# EAGLE design uMatrixPCB_r1.0 (EAGLE 6.5.0)
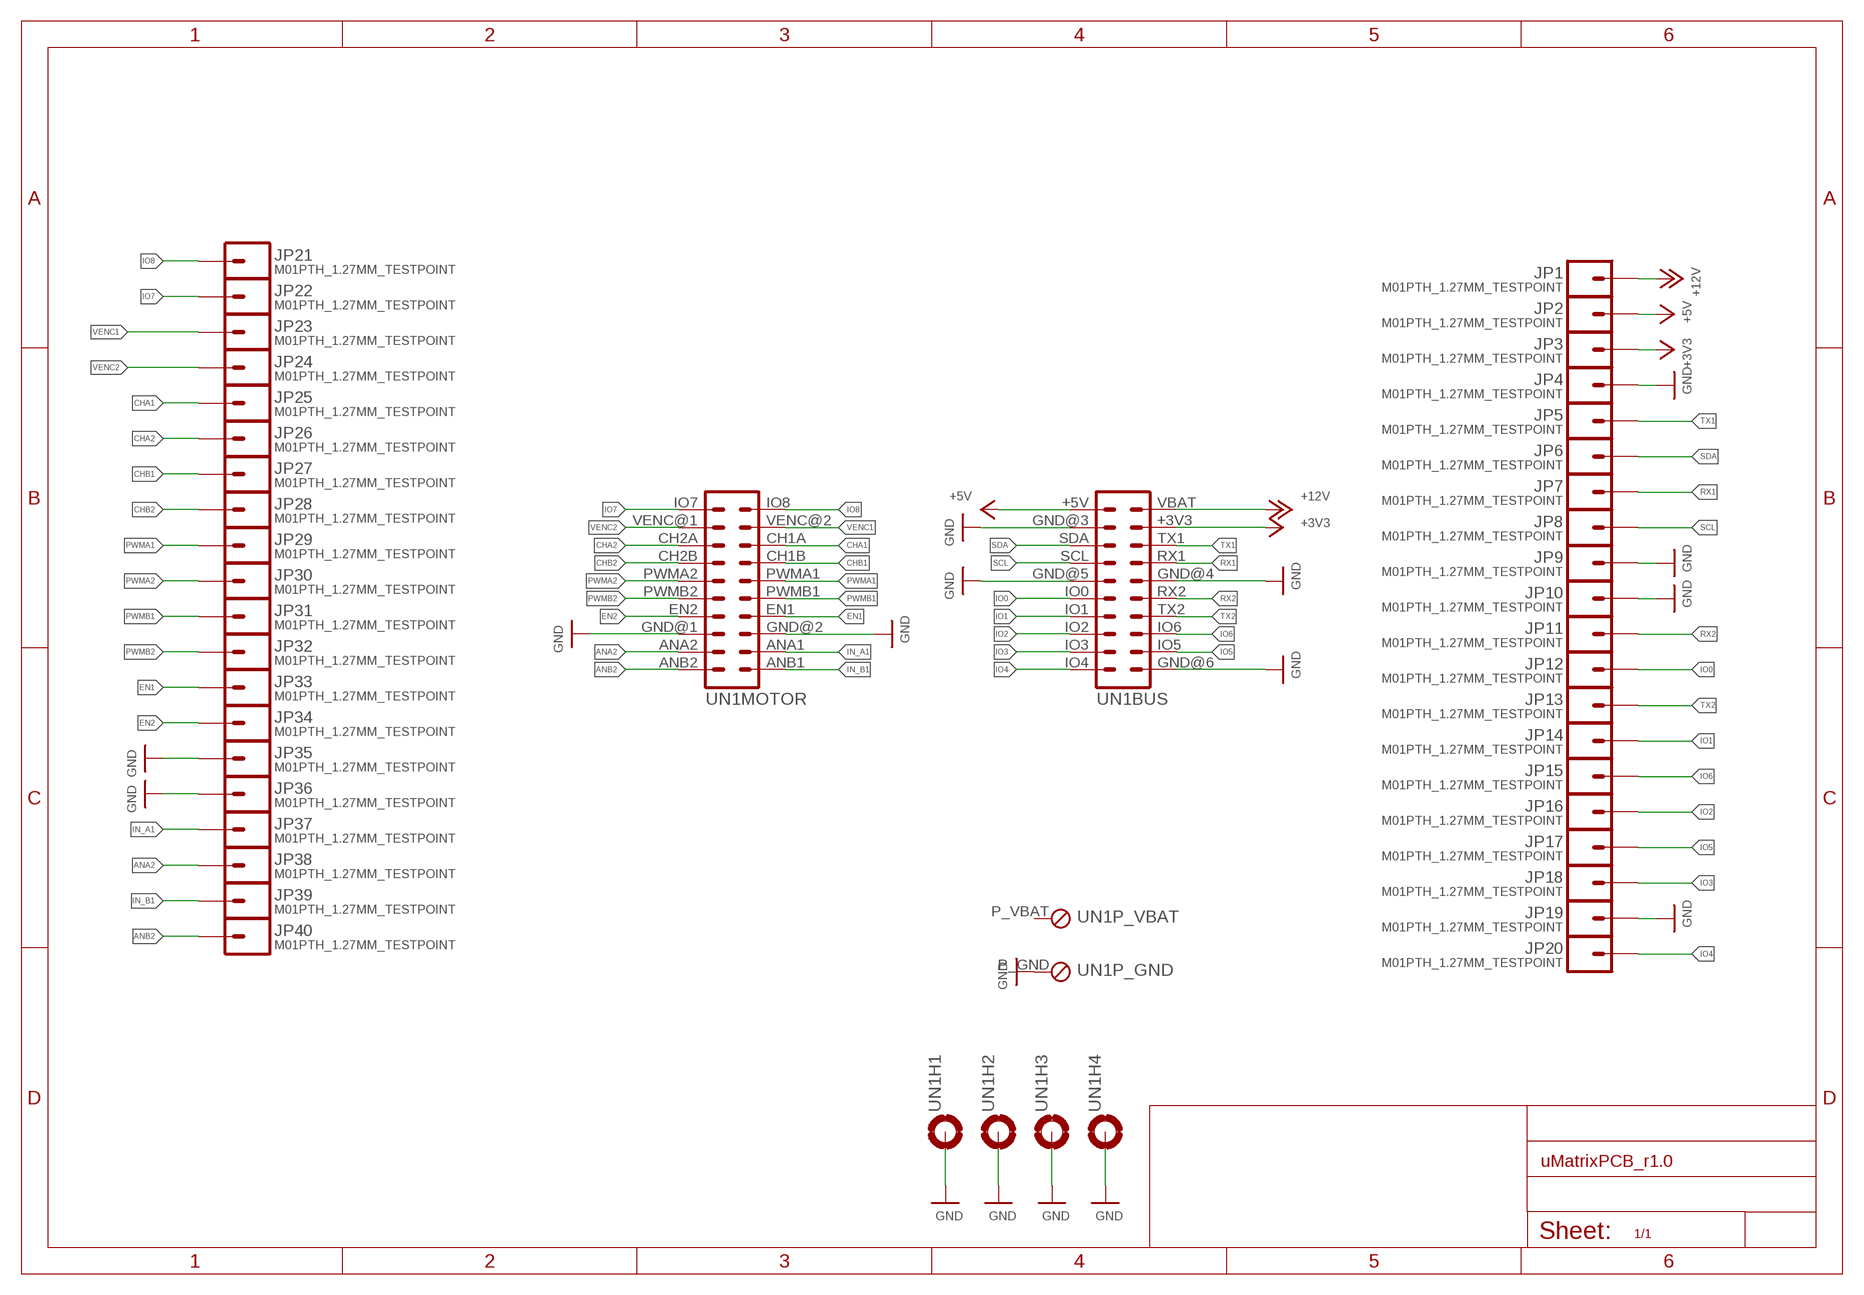
[diagram p0: schematic, sheet 1]

## Parts
JP1  M01PTH_1.27MM_TESTPOINT  [1X0.127_TESTPOINT]
JP2  M01PTH_1.27MM_TESTPOINT  [1X0.127_TESTPOINT]
JP3  M01PTH_1.27MM_TESTPOINT  [1X0.127_TESTPOINT]
JP4  M01PTH_1.27MM_TESTPOINT  [1X0.127_TESTPOINT]
JP5  M01PTH_1.27MM_TESTPOINT  [1X0.127_TESTPOINT]
JP6  M01PTH_1.27MM_TESTPOINT  [1X0.127_TESTPOINT]
JP7  M01PTH_1.27MM_TESTPOINT  [1X0.127_TESTPOINT]
JP8  M01PTH_1.27MM_TESTPOINT  [1X0.127_TESTPOINT]
JP9  M01PTH_1.27MM_TESTPOINT  [1X0.127_TESTPOINT]
JP10  M01PTH_1.27MM_TESTPOINT  [1X0.127_TESTPOINT]
JP11  M01PTH_1.27MM_TESTPOINT  [1X0.127_TESTPOINT]
JP12  M01PTH_1.27MM_TESTPOINT  [1X0.127_TESTPOINT]
JP13  M01PTH_1.27MM_TESTPOINT  [1X0.127_TESTPOINT]
JP14  M01PTH_1.27MM_TESTPOINT  [1X0.127_TESTPOINT]
JP15  M01PTH_1.27MM_TESTPOINT  [1X0.127_TESTPOINT]
JP16  M01PTH_1.27MM_TESTPOINT  [1X0.127_TESTPOINT]
JP17  M01PTH_1.27MM_TESTPOINT  [1X0.127_TESTPOINT]
JP18  M01PTH_1.27MM_TESTPOINT  [1X0.127_TESTPOINT]
JP19  M01PTH_1.27MM_TESTPOINT  [1X0.127_TESTPOINT]
JP20  M01PTH_1.27MM_TESTPOINT  [1X0.127_TESTPOINT]
JP21  M01PTH_1.27MM_TESTPOINT  [1X0.127_TESTPOINT]
JP22  M01PTH_1.27MM_TESTPOINT  [1X0.127_TESTPOINT]
JP23  M01PTH_1.27MM_TESTPOINT  [1X0.127_TESTPOINT]
JP24  M01PTH_1.27MM_TESTPOINT  [1X0.127_TESTPOINT]
JP25  M01PTH_1.27MM_TESTPOINT  [1X0.127_TESTPOINT]
JP26  M01PTH_1.27MM_TESTPOINT  [1X0.127_TESTPOINT]
JP27  M01PTH_1.27MM_TESTPOINT  [1X0.127_TESTPOINT]
JP28  M01PTH_1.27MM_TESTPOINT  [1X0.127_TESTPOINT]
JP29  M01PTH_1.27MM_TESTPOINT  [1X0.127_TESTPOINT]
JP30  M01PTH_1.27MM_TESTPOINT  [1X0.127_TESTPOINT]
JP31  M01PTH_1.27MM_TESTPOINT  [1X0.127_TESTPOINT]
JP32  M01PTH_1.27MM_TESTPOINT  [1X0.127_TESTPOINT]
JP33  M01PTH_1.27MM_TESTPOINT  [1X0.127_TESTPOINT]
JP34  M01PTH_1.27MM_TESTPOINT  [1X0.127_TESTPOINT]
JP35  M01PTH_1.27MM_TESTPOINT  [1X0.127_TESTPOINT]
JP36  M01PTH_1.27MM_TESTPOINT  [1X0.127_TESTPOINT]
JP37  M01PTH_1.27MM_TESTPOINT  [1X0.127_TESTPOINT]
JP38  M01PTH_1.27MM_TESTPOINT  [1X0.127_TESTPOINT]
JP39  M01PTH_1.27MM_TESTPOINT  [1X0.127_TESTPOINT]
JP40  M01PTH_1.27MM_TESTPOINT  [1X0.127_TESTPOINT]
UN1  UNAV  [UNAV_BOARD]

## Nets
+3V3: JP3.1 UN1.+3V3
+5V: JP2.1 UN1.+5V
+12V: JP1.1 UN1.VBAT
ANA2: JP38.1 UN1.ANA2
ANB2: JP40.1 UN1.ANB2
CHA1: JP25.1 UN1.CH1A
CHA2: JP26.1 UN1.CH2A
CHB1: JP27.1 UN1.CH1B
CHB2: JP28.1 UN1.CH2B
EN1: JP33.1 UN1.EN1
EN2: JP34.1 UN1.EN2
GND: JP4.1 JP9.1 JP10.1 JP19.1 JP35.1 JP36.1 UN1.GND@1 UN1.GND@2 UN1.GND@3 UN1.GND@4 UN1.GND@5 UN1.GND@6 UN1.H1(H1:MOUNT) UN1.H2(H2:MOUNT) UN1.H3(H3:MOUNT) UN1.H4(H4:MOUNT) UN1.P_GND
IN_A1: JP37.1 UN1.ANA1
IN_B1: JP39.1 UN1.ANB1
IO0: JP12.1 UN1.IO0
IO1: JP14.1 UN1.IO1
IO2: JP16.1 UN1.IO2
IO3: JP18.1 UN1.IO3
IO4: JP20.1 UN1.IO4
IO5: JP17.1 UN1.IO5
IO6: JP15.1 UN1.IO6
IO7: JP22.1 UN1.IO7
IO8: JP21.1 UN1.IO8
PWMA1: JP29.1 UN1.PWMA1
PWMA2: JP30.1 UN1.PWMA2
PWMB1: JP31.1 UN1.PWMB1
PWMB2: JP32.1 UN1.PWMB2
RX1: JP7.1 UN1.RX1
RX2: JP11.1 UN1.RX2
SCL: JP8.1 UN1.SCL
SDA: JP6.1 UN1.SDA
TX1: JP5.1 UN1.TX1
TX2: JP13.1 UN1.TX2
VENC1: JP23.1 UN1.VENC@2
VENC2: JP24.1 UN1.VENC@1
Unconnected: UN1.P_VBAT

## Library data of the parts
JP1-JP40 = OfficineRobotiche:M01: Header 1 Standard 1-pin 0.1" header. Use with straight break away headers (SKU : PRT-00116), right angle break away headers (PRT-00553), swiss pins (PRT-00743), machine pins (PRT-00117), and female headers (PRT-00115).
UN1 = OfficineRobotiche:UNAV: https://github.com/officinerobotiche/uNAVPCB

## Net classes
0 default: width 0.254 mm, drill 0.406 mm, clearance 0.178 mm
1 power: width 0.305 mm, drill 0.406 mm, clearance 0.203 mm

## Board
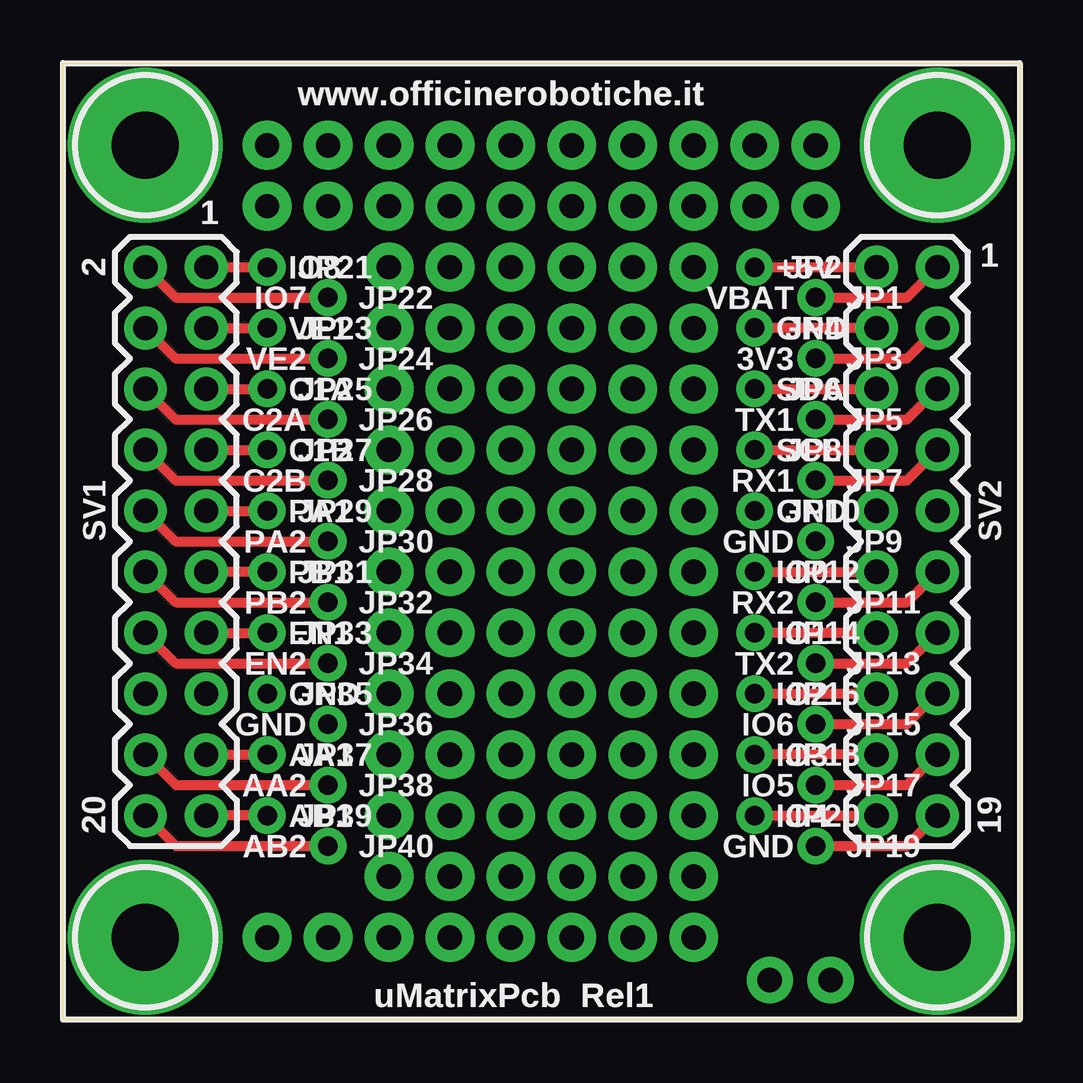
[diagram p1: board, top side]
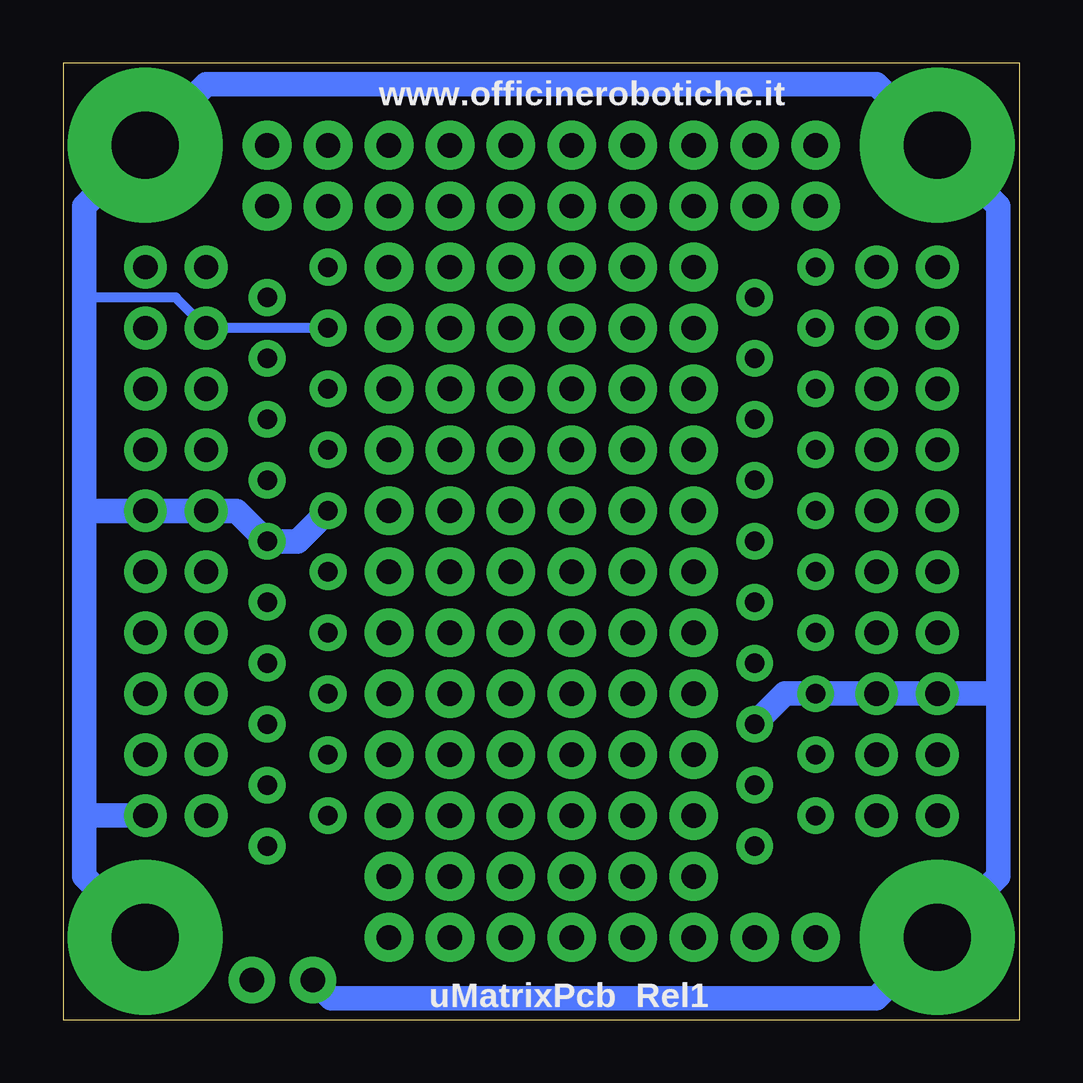
[diagram p2: board, bottom side, seen from below]

Size 39.88 x 39.88 mm. Coordinates in mm from the lower left corner, seen from the top.
Outline: 39.88,0 0,0 0,39.88 39.88,39.88 39.88,0
Copper layers (1*16): Top 0.035mm / dielectric 1.5mm / Bottom 0.035mm
Design rules "default": minimum track width 8mil, minimum drill 12mil, track to track 8mil, track to pad 8mil, pad to pad 8mil, via to via 8mil, smd to smd 8mil, copper to edge 10mil, drill to drill 8mil, minimum pad ring 12mil, minimum via ring 8mil, stop-mask expansion 4mil, vias tented up to drill 20mil, thermal gap 10mil

### Footprints (pad centres in the part's own frame; a part is rotated, then mirrored left to right if it is on the bottom)
1X0.127_TESTPOINT = drill 0.813 pad 1.524: 1 0,0
UNAV_BOARD = drill 1.016 pad 1.778: +3V3 33.02,25.4; +5V 30.48,27.94; ANA1 2.54,7.62; ANA2 0,7.62; ANB1 2.54,5.08; ANB2 0,5.08; CH1A 2.54,22.86; CH1B 2.54,20.32; CH2A 0,22.86; CH2B 0,20.32; EN1 2.54,12.7; EN2 0,12.7; GND@1 0,10.16; GND@2 2.54,10.16; GND@3 30.48,25.4; GND@4 33.02,17.78; GND@5 30.48,17.78; GND@6 33.02,5.08; IO0 30.48,15.24; IO1 30.48,12.7; IO2 30.48,10.16; IO3 30.48,7.62; IO4 30.48,5.08; IO5 33.02,7.62; IO6 33.02,10.16; IO7 0,27.94; IO8 2.54,27.94; PWMA1 2.54,17.78; PWMA2 0,17.78; PWMB1 2.54,15.24; PWMB2 0,15.24; RX1 33.02,20.32; RX2 33.02,15.24; SCL 30.48,20.32; SDA 30.48,22.86; TX1 33.02,22.86; TX2 33.02,12.7; VBAT 33.02,27.94; VENC@1 0,25.4; VENC@2 2.54,25.4 | drill 2.8 pad 6.452: H1 0,33.02; H2 33.02,33.02; H3 33.02,0; H4 0,0 | drill 1.016 pad 1.93: P_GND 26.035,-1.778; P_VBAT 28.575,-1.778

### Placement (x,y rotation side)
JP1  31.37,30.1 0 top
JP2  28.83,31.37 0 top
JP3  31.37,27.56 0 top
JP4  28.83,28.83 0 top
JP5  31.37,25.02 0 top
JP6  28.83,26.29 0 top
JP7  31.37,22.48 0 top
JP8  28.83,23.75 0 top
JP9  31.37,19.94 0 top
JP10  28.83,21.21 0 top
JP11  31.37,17.4 0 top
JP12  28.83,18.67 0 top
JP13  31.37,14.86 0 top
JP14  28.83,16.13 0 top
JP15  31.37,12.32 0 top
JP16  28.83,13.59 0 top
JP17  31.37,9.78 0 top
JP18  28.83,11.05 0 top
JP19  31.37,7.24 0 top
JP20  28.83,8.51 0 top
JP21  8.51,31.37 0 top
JP22  11.05,30.1 0 top
JP23  8.51,28.83 0 top
JP24  11.05,27.56 0 top
JP25  8.51,26.29 0 top
JP26  11.05,25.02 0 top
JP27  8.51,23.75 0 top
JP28  11.05,22.48 0 top
JP29  8.51,21.21 0 top
JP30  11.05,19.94 0 top
JP31  8.51,18.67 0 top
JP32  11.05,17.4 0 top
JP33  8.51,16.13 0 top
JP34  11.05,14.86 0 top
JP35  8.51,13.59 0 top
JP36  11.05,12.32 0 top
JP37  8.51,11.05 0 top
JP38  11.05,9.78 0 top
JP39  8.51,8.51 0 top
JP40  11.05,7.24 0 top
UN1  3.43,3.43 0 top

### Tracks (layer width: path | path; a pad name or v marks a point on that pad's centre or on a via)
+3V3
  Top 0.406: JP3.1 35.18,27.56 UN1.+3V3
+5V
  Top 0.406: JP2.1 UN1.+5V
+12V
  Top 0.406: JP1.1 35.18,30.1 UN1.VBAT
ANA2
  Top 0.406: UN1.ANA2 4.7,9.78 JP38.1
ANB2
  Top 0.406: UN1.ANB2 4.7,7.24 JP40.1
CHA1
  Top 0.406: UN1.CH1A JP25.1
CHA2
  Top 0.406: UN1.CH2A 4.7,25.02 JP26.1
CHB1
  Top 0.406: UN1.CH1B JP27.1
CHB2
  Top 0.406: UN1.CH2B 4.7,22.48 JP28.1
EN1
  Top 0.406: UN1.EN1 JP33.1
EN2
  Top 0.406: UN1.EN2 4.7,14.86 JP34.1
GND
  Top 0.406: JP19.1 35.18,7.24 UN1.GND@6 | UN1.GND@3 JP4.1
  Bottom 0.406: JP4.1 UN1.GND@3 35.18,30.1 38.99,30.1
  Bottom 1.016: UN1.H3 38.99,5.97 38.99,8.51 | 38.99,8.51 38.99,21.21 | 38.99,21.21 38.99,30.1 38.99,33.91 UN1.H2 33.91,38.99 5.97,38.99 UN1.H1 0.89,33.91 0.89,13.59 | 0.89,13.59 0.89,5.97 UN1.H4 5.97,0.89 | UN1.P_GND 28.7,0.89 5.97,0.89 | 6.86,0.89 5.97,0.89 | UN1.GND@6 38.99,8.51 | 38.99,21.21 UN1.GND@4 UN1.GND@5 32.64,21.21 JP9.1 30.1,19.94 JP10.1 | 0.89,13.59 UN1.GND@1 UN1.GND@2 JP35.1 9.78,13.59 JP36.1
IN_A1
  Top 0.406: UN1.ANA1 JP37.1
IN_B1
  Top 0.406: JP39.1 UN1.ANB1
IO0
  Top 0.406: JP12.1 UN1.IO0
IO1
  Top 0.406: UN1.IO1 JP14.1
IO2
  Top 0.406: JP16.1 UN1.IO2
IO3
  Top 0.406: UN1.IO3 JP18.1
IO4
  Top 0.406: JP20.1 UN1.IO4
IO5
  Top 0.406: JP17.1 35.18,9.78 UN1.IO5
IO6
  Top 0.406: JP15.1 35.18,12.32 UN1.IO6
IO7
  Top 0.406: UN1.IO7 4.7,30.1 JP22.1
IO8
  Top 0.406: UN1.IO8 JP21.1
N$1  (via drill 1.02 pad 2.03)
  other vias: 8.51,3.43
N$2  (via drill 1.02 pad 2.03)
  other vias: 11.05,3.43
N$3  (via drill 1.02 pad 2.03)
  other vias: 16.13,3.43
N$4  (via drill 1.02 pad 2.03)
  other vias: 13.59,3.43
N$5  (via drill 1.02 pad 2.03)
  other vias: 18.67,3.43
N$6  (via drill 1.02 pad 2.03)
  other vias: 21.21,3.43
N$7  (via drill 1.02 pad 2.03)
  other vias: 23.75,3.43
N$8  (via drill 1.02 pad 2.03)
  other vias: 26.29,3.43
N$13  (via drill 1.02 pad 2.03)
  other vias: 8.51,33.91
N$14  (via drill 1.02 pad 2.03)
  other vias: 8.51,36.45
N$15  (via drill 1.02 pad 2.03)
  other vias: 11.05,36.45
N$16  (via drill 1.02 pad 2.03)
  other vias: 13.59,36.45
N$17  (via drill 1.02 pad 2.03)
  other vias: 16.13,36.45
N$18  (via drill 1.02 pad 2.03)
  other vias: 18.67,36.45
N$19  (via drill 1.02 pad 2.03)
  other vias: 21.21,36.45
N$20  (via drill 1.02 pad 2.03)
  other vias: 23.75,36.45
N$21  (via drill 1.02 pad 2.03)
  other vias: 26.29,36.45
N$22  (via drill 1.02 pad 2.03)
  other vias: 28.83,36.45
N$23  (via drill 1.02 pad 2.03)
  other vias: 28.83,33.91
N$24  (via drill 1.02 pad 2.03)
  other vias: 31.37,33.91
N$25  (via drill 1.02 pad 2.03)
  other vias: 31.37,36.45
N$26  (via drill 1.02 pad 2.03)
  other vias: 26.29,33.91
N$27  (via drill 1.02 pad 2.03)
  other vias: 23.75,33.91
N$28  (via drill 1.02 pad 2.03)
  other vias: 21.21,33.91
N$29  (via drill 1.02 pad 2.03)
  other vias: 16.13,33.91
N$30  (via drill 1.02 pad 2.03)
  other vias: 18.67,33.91
N$31  (via drill 1.02 pad 2.03)
  other vias: 13.59,33.91
N$32  (via drill 1.02 pad 2.03)
  other vias: 11.05,33.91
N$34  (via drill 1.02 pad 2.03)
  other vias: 13.59,31.37
N$35  (via drill 1.02 pad 2.03)
  other vias: 16.13,31.37
N$36  (via drill 1.02 pad 2.03)
  other vias: 18.67,31.37
N$37  (via drill 1.02 pad 2.03)
  other vias: 21.21,31.37
N$38  (via drill 1.02 pad 2.03)
  other vias: 23.75,31.37
N$39  (via drill 1.02 pad 2.03)
  other vias: 26.29,31.37
N$44  (via drill 1.02 pad 2.03)
  other vias: 26.29,28.83
N$45  (via drill 1.02 pad 2.03)
  other vias: 23.75,28.83
N$46  (via drill 1.02 pad 2.03)
  other vias: 21.21,28.83
N$47  (via drill 1.02 pad 2.03)
  other vias: 18.67,28.83
N$48  (via drill 1.02 pad 2.03)
  other vias: 16.13,28.83
N$49  (via drill 1.02 pad 2.03)
  other vias: 13.59,28.83
N$52  (via drill 1.02 pad 2.03)
  other vias: 16.13,26.29
N$53  (via drill 1.02 pad 2.03)
  other vias: 13.59,26.29
N$54  (via drill 1.02 pad 2.03)
  other vias: 18.67,26.29
N$55  (via drill 1.02 pad 2.03)
  other vias: 21.21,26.29
N$56  (via drill 1.02 pad 2.03)
  other vias: 23.75,26.29
N$57  (via drill 1.02 pad 2.03)
  other vias: 26.29,26.29
N$62  (via drill 1.02 pad 2.03)
  other vias: 23.75,23.75
N$63  (via drill 1.02 pad 2.03)
  other vias: 21.21,23.75
N$64  (via drill 1.02 pad 2.03)
  other vias: 18.67,23.75
N$65  (via drill 1.02 pad 2.03)
  other vias: 16.13,23.75
N$66  (via drill 1.02 pad 2.03)
  other vias: 13.59,23.75
N$69  (via drill 1.02 pad 2.03)
  other vias: 13.59,21.21
N$70  (via drill 1.02 pad 2.03)
  other vias: 16.13,21.21
N$71  (via drill 1.02 pad 2.03)
  other vias: 18.67,21.21
N$72  (via drill 1.02 pad 2.03)
  other vias: 21.21,21.21
N$73  (via drill 1.02 pad 2.03)
  other vias: 23.75,21.21
N$74  (via drill 1.02 pad 2.03)
  other vias: 26.29,21.21
N$75  (via drill 1.02 pad 2.03)
  other vias: 26.29,23.75
N$92  (via drill 1.02 pad 2.03)
  other vias: 26.29,5.97
N$93  (via drill 1.02 pad 2.03)
  other vias: 26.29,8.51
N$94  (via drill 1.02 pad 2.03)
  other vias: 26.29,11.05
N$95  (via drill 1.02 pad 2.03)
  other vias: 26.29,13.59
N$96  (via drill 1.02 pad 2.03)
  other vias: 26.29,16.13
N$97  (via drill 1.02 pad 2.03)
  other vias: 26.29,18.67
N$98  (via drill 1.02 pad 2.03)
  other vias: 23.75,18.67
N$99  (via drill 1.02 pad 2.03)
  other vias: 23.75,16.13
N$100  (via drill 1.02 pad 2.03)
  other vias: 23.75,13.59
N$101  (via drill 1.02 pad 2.03)
  other vias: 23.75,11.05
N$102  (via drill 1.02 pad 2.03)
  other vias: 23.75,8.51
N$103  (via drill 1.02 pad 2.03)
  other vias: 23.75,5.97
N$104  (via drill 1.02 pad 2.03)
  other vias: 21.21,5.97
N$105  (via drill 1.02 pad 2.03)
  other vias: 21.21,8.51
N$106  (via drill 1.02 pad 2.03)
  other vias: 21.21,11.05
N$107  (via drill 1.02 pad 2.03)
  other vias: 21.21,13.59
N$108  (via drill 1.02 pad 2.03)
  other vias: 21.21,16.13
N$109  (via drill 1.02 pad 2.03)
  other vias: 21.21,18.67
N$123  (via drill 1.02 pad 2.03)
  other vias: 13.59,18.67
N$124  (via drill 1.02 pad 2.03)
  other vias: 13.59,16.13
N$125  (via drill 1.02 pad 2.03)
  other vias: 13.59,13.59
N$126  (via drill 1.02 pad 2.03)
  other vias: 13.59,11.05
N$127  (via drill 1.02 pad 2.03)
  other vias: 13.59,8.51
N$128  (via drill 1.02 pad 2.03)
  other vias: 13.59,5.97
N$129  (via drill 1.02 pad 2.03)
  other vias: 16.13,5.97
N$130  (via drill 1.02 pad 2.03)
  other vias: 16.13,8.51
N$131  (via drill 1.02 pad 2.03)
  other vias: 18.67,8.51
N$132  (via drill 1.02 pad 2.03)
  other vias: 18.67,5.97
N$133  (via drill 1.02 pad 2.03)
  other vias: 18.67,11.05
N$134  (via drill 1.02 pad 2.03)
  other vias: 18.67,13.59
N$135  (via drill 1.02 pad 2.03)
  other vias: 18.67,16.13
N$136  (via drill 1.02 pad 2.03)
  other vias: 18.67,18.67
N$137  (via drill 1.02 pad 2.03)
  other vias: 16.13,18.67
N$138  (via drill 1.02 pad 2.03)
  other vias: 16.13,16.13
N$139  (via drill 1.02 pad 2.03)
  other vias: 16.13,13.59
N$140  (via drill 1.02 pad 2.03)
  other vias: 16.13,11.05
PWMA1
  Top 0.406: UN1.PWMA1 JP29.1
PWMA2
  Top 0.406: UN1.PWMA2 4.7,19.94 JP30.1
PWMB1
  Top 0.406: JP31.1 UN1.PWMB1
PWMB2
  Top 0.406: UN1.PWMB2 4.7,17.4 JP32.1
RX1
  Top 0.406: JP7.1 35.18,22.48 UN1.RX1
RX2
  Top 0.406: JP11.1 35.18,17.4 UN1.RX2
SCL
  Top 0.406: JP8.1 UN1.SCL
SDA
  Top 0.406: JP6.1 UN1.SDA
TX1
  Top 0.406: JP5.1 35.18,25.02 UN1.TX1
TX2
  Top 0.406: JP13.1 35.18,14.86 UN1.TX2
VENC1
  Top 0.406: UN1.VENC@2 JP23.1
VENC2
  Top 0.406: UN1.VENC@1 4.7,27.56 JP24.1

### Text on the board
tPlace: www.officinerobotiche.it | uMatrixPcb Rel1
bPlace: www.officinerobotiche.it | uMatrixPcb Rel1
_tsilk: www.officinerobotiche.it | 1 | 2 | IO8 | +5V | 1 | IO7 | VBAT | VE1 | GND | VE2 | 3V3 | C1A | SDA | C2A | TX1 | C1B | SCL | C2B | RX1 | PA1 | GND | SV1 | PA2 | GND | SV2 | PB1 | IO0 | PB2 | RX2 | EN1 | IO1 | EN2 | TX2 | GND | IO2 | GND | IO6 | AA1 | IO3 | AA2 | IO5 | AB1 | IO4 | 20 | AB2 | GND | 19 | uMatrixPcb Rel1
_bsilk: www.officinerobotiche.it | 1 | 1 | 2 | SV1 | 20 | 19 | uMatrixPcb Rel1